# Altium schematic sheet SHDN-S10-ShutdownRelay.SchDoc
size A3
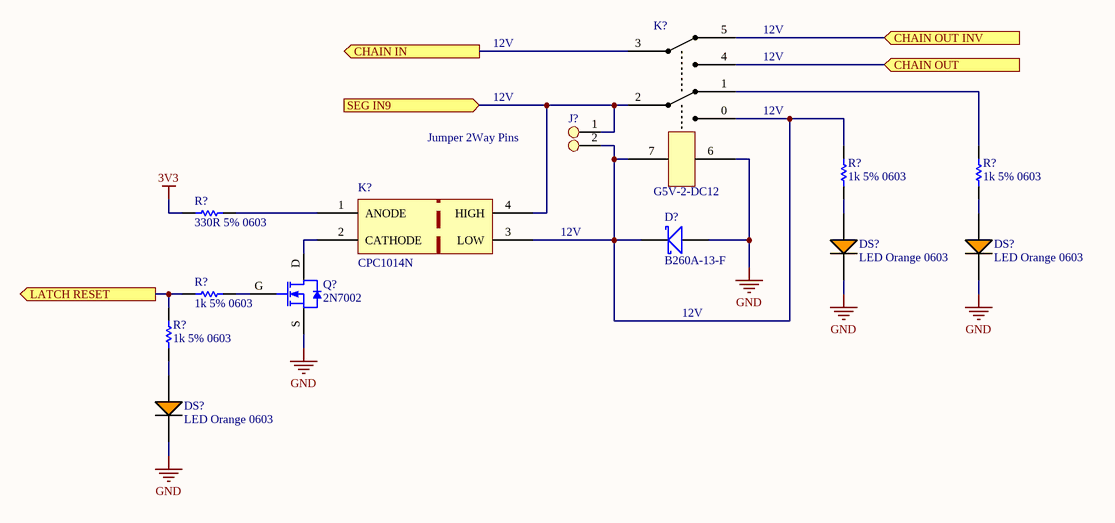
[diagram p0: SHDN-S10-ShutdownRelay.SchDoc]

## Parts
(Parts that share a designator on the sheet are numbered #1, #2 ... from top to bottom, then left to right.)
D?  B260A-13-F  [SMA]
DS?#1  LED Orange 0603  [LED ORANGE 0603]
DS?#2  LED Orange 0603  [LED ORANGE 0603]
DS?#3  LED Orange 0603  [LED ORANGE 0603]
J?  Jumper 2Way Pins  [Jumper_2Way_Pin]
K?#1  G5V-2-DC12
K?#2  CPC1014N  [CPC1014N]
Q?  2N7002  [SOT23-3]
R?#1  1k 5% 0603  [Res_ThinFilm_0603]
R?#2  1k 5% 0603  [Res_ThinFilm_0603]
R?#3  330R 5% 0603  [Res_ThinFilm_0603]
R?#4  1k 5% 0603  [Res_ThinFilm_0603]
R?#5  1k 5% 0603  [Res_ThinFilm_0603]

## Ports
CHAIN IN (out), CHAIN OUT (in), CHAIN OUT INV (in), LATCH RESET (out), SEG IN9 (in)

## Nets
3V3: R?#3.1
GND: D?.1(A) DS?#1.2(C) DS?#2.2(C) DS?#3.2(C) K?#1.6 Q?.S
CHAIN IN: K?#1.3 ; port CHAIN IN
CHAIN OUT: K?#1.4 ; port CHAIN OUT
CHAIN OUT INV: K?#1.5 ; port CHAIN OUT INV
LATCH RESET: R?#4.1 R?#5.2 ; port LATCH RESET
SEG IN9: J?.1 K?#1.2 K?#2.4(HIGH) ; port SEG IN9
NetD?_2: D?.2(K) J?.2 K?#1.0 K?#1.7 K?#2.3(LOW) R?#1.2
NetDS?#1_1: DS?#1.1(A) R?#1.1
NetDS?#2_1: DS?#2.1(A) R?#2.1
NetDS?#3_1: DS?#3.1(A) R?#5.1
NetK?#1_1: K?#1.1 R?#2.2
NetK?#2_1: K?#2.1(ANODE) R?#3.2
NetK?#2_2: K?#2.2(CATHODE) Q?.D
NetQ?_G: Q?.G R?#4.2

## Notes on the sheet
- 12V
- Revision History:
- Sheet Title:
- Rev
- Date
- Description
- Project:
- Size:
- Drawn By:
- A3
- Number:
- Revision:
- Sheet
- Version:
- of
- QUT Motorsport
- O-120, Gardens Point
- 2 George Street
- Brisbane, QLD 4000
- Australia
- Print Date:
- Print Time:
- File Name:

## Library data of the parts
D? = B260A-13-F: Diode, Schottky Barrier Rectifier, 60 V, 2 A, B260A-13-F
J? = Jumper 2Way Side Pins
K?#1 = G5V-2-DC12: General Purpose Relay DPDT (2 Form C) Through Hole, 12V, 2A
K?#2 = CPC1014N: Solid State SPST-NO (1 Form A) 4-SOP (0.150", 3.81mm)
R?#1 R?#2 R?#4 R?#5 = 1k 5% 0603: Resistor, SMD, 1k, 0.1W, 5%, 0603
R?#3 = 330R 5% 0603: Resistor, SMD, 330R, 0.1W, 5%, 0603